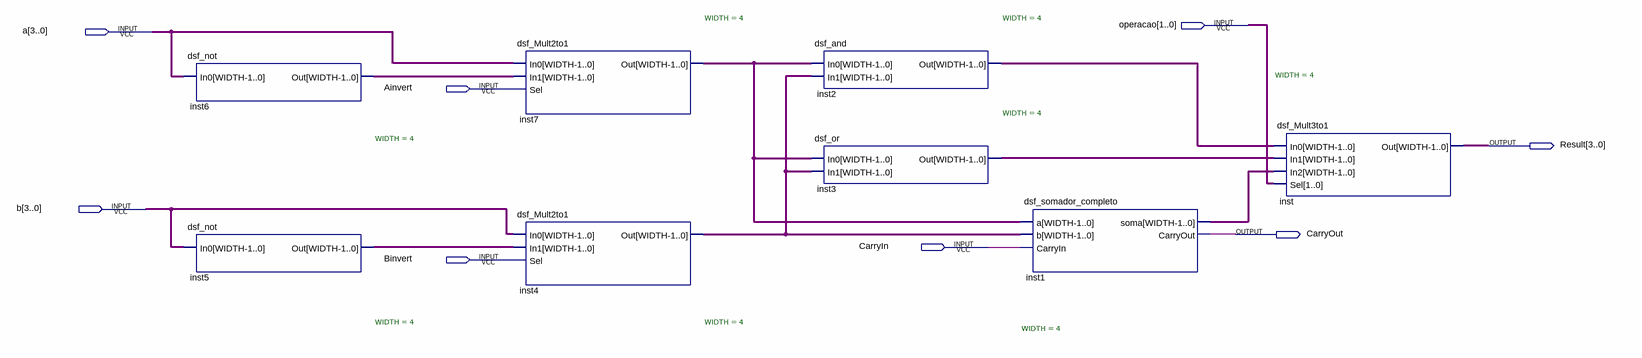
[diagram p0: schematic sheet]
// Quartus schematic dsf_ALU.bdf as structural Verilog: 8 symbols, 8 pins
module dsf_ALU (
  input  [1:0] operacao,
  input  [3:0] a,
  input  Ainvert,
  input  [3:0] b,
  input  CarryIn,
  input  Binvert,
  output [3:0] Result,
  output CarryOut
);

  wire [3:0] inst1_soma, inst2_out, inst3_out, inst4_out, inst5_out, inst6_out, inst7_out;

  dsf_not #(.WIDTH(4)) inst6 (.In0(a), .Out(inst6_out));
  dsf_not #(.WIDTH(4)) inst5 (.In0(b), .Out(inst5_out));
  dsf_Mult2to1 #(.WIDTH(4)) inst7 (.In0(a), .In1(inst6_out), .Sel(Ainvert), .Out(inst7_out));
  dsf_Mult2to1 #(.WIDTH(4)) inst4 (.In0(b), .In1(inst5_out), .Sel(Binvert), .Out(inst4_out));
  dsf_and #(.WIDTH(4)) inst2 (.In0(inst7_out), .In1(inst4_out), .Out(inst2_out));
  dsf_or #(.WIDTH(4)) inst3 (.In0(inst7_out), .In1(inst4_out), .Out(inst3_out));
  dsf_somador_completo #(.WIDTH(4)) inst1 (
    .a(inst7_out), .b(inst4_out), .CarryIn(CarryIn), .soma(inst1_soma), .CarryOut(CarryOut));
  dsf_Mult3to1 #(.WIDTH(4)) inst (.In0(inst2_out), .In1(inst3_out), .In2(inst1_soma), .Sel(operacao), .Out(Result));
endmodule
